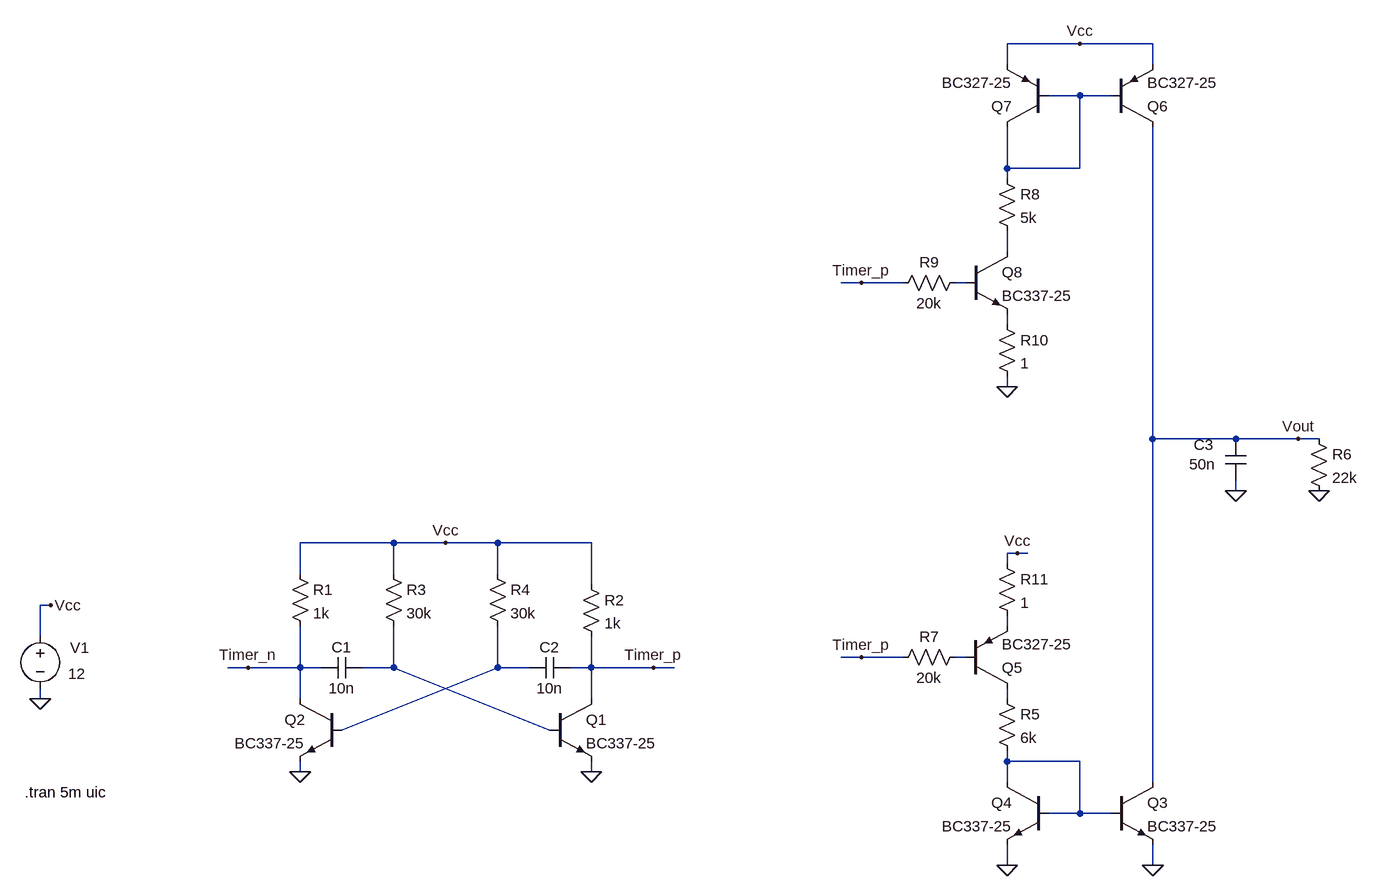
[diagram p0: schematic Proiect1_v2.asc]
Proiect1_v2.asc, the LTspice schematic file:
Version 4
SHEET 1 1956 956
WIRE 1088 -928 976 -928
WIRE 1200 -928 1088 -928
WIRE 976 -896 976 -928
WIRE 1200 -896 1200 -928
WIRE 1088 -848 1040 -848
WIRE 1136 -848 1088 -848
WIRE 976 -736 976 -800
WIRE 1088 -736 1088 -848
WIRE 1088 -736 976 -736
WIRE 976 -720 976 -736
WIRE 976 -608 976 -640
WIRE 752 -560 720 -560
WIRE 816 -560 752 -560
WIRE 912 -560 896 -560
WIRE 976 -496 976 -512
WIRE 976 -400 976 -416
WIRE 1200 -320 1200 -800
WIRE 1328 -320 1200 -320
WIRE 1424 -320 1328 -320
WIRE 1456 -320 1424 -320
WIRE 1328 -240 1328 -256
WIRE 32 -160 -112 -160
WIRE 112 -160 32 -160
WIRE 192 -160 112 -160
WIRE 336 -160 192 -160
WIRE 992 -144 976 -144
WIRE 1008 -144 992 -144
WIRE 976 -128 976 -144
WIRE -112 -112 -112 -160
WIRE 32 -112 32 -160
WIRE 192 -112 192 -160
WIRE 336 -96 336 -160
WIRE -496 -64 -512 -64
WIRE 976 -32 976 -48
WIRE -512 -16 -512 -64
WIRE 752 16 720 16
WIRE 816 16 752 16
WIRE 912 16 896 16
WIRE -192 32 -224 32
WIRE -112 32 -112 -32
WIRE -112 32 -192 32
WIRE -80 32 -112 32
WIRE 32 32 32 -32
WIRE 32 32 -16 32
WIRE 192 32 192 -32
WIRE 240 32 192 32
WIRE 336 32 336 -16
WIRE 336 32 304 32
WIRE 432 32 336 32
WIRE 464 32 432 32
WIRE -512 80 -512 64
WIRE -112 80 -112 32
WIRE 336 80 336 32
WIRE 976 80 976 64
WIRE -48 128 192 32
WIRE 272 128 32 32
WIRE 976 176 976 160
WIRE 1088 176 976 176
WIRE -112 192 -112 176
WIRE 336 192 336 176
WIRE 976 208 976 176
WIRE 1200 208 1200 -320
WIRE 1088 256 1088 176
WIRE 1088 256 1040 256
WIRE 1136 256 1088 256
WIRE 976 336 976 304
WIRE 1200 336 1200 304
FLAG -112 192 0
FLAG 336 192 0
FLAG -512 80 0
FLAG -496 -64 Vcc
FLAG 112 -160 Vcc
FLAG 432 32 Timer_p
FLAG -192 32 Timer_n
FLAG 976 336 0
FLAG 1200 336 0
FLAG 1328 -240 0
FLAG 1456 -240 0
FLAG 992 -144 Vcc
FLAG 1088 -928 Vcc
FLAG 1424 -320 Vout
FLAG 752 -560 Timer_p
FLAG 752 16 Timer_p
FLAG 976 -400 0
SYMBOL npn 272 80 R0
SYMATTR InstName Q1
SYMATTR Value BC337-25
SYMBOL npn -48 80 M0
SYMATTR InstName Q2
SYMATTR Value BC337-25
SYMBOL res -128 -128 R0
SYMATTR InstName R1
SYMATTR Value 1k
SYMBOL res 320 -112 R0
SYMATTR InstName R2
SYMATTR Value 1k
SYMBOL cap -16 16 R90
WINDOW 0 0 32 VBottom 2
WINDOW 3 32 32 VTop 2
SYMATTR InstName C1
SYMATTR Value 10n
SYMBOL cap 304 16 R90
WINDOW 0 0 32 VBottom 2
WINDOW 3 32 32 VTop 2
SYMATTR InstName C2
SYMATTR Value 10n
SYMBOL res 16 -128 R0
SYMATTR InstName R3
SYMATTR Value 30k
SYMBOL res 176 -128 R0
SYMATTR InstName R4
SYMATTR Value 30k
SYMBOL voltage -512 -32 R0
WINDOW 0 46 33 Left 2
WINDOW 3 43 73 Left 2
WINDOW 123 0 0 Left 0
WINDOW 39 0 0 Left 0
SYMATTR InstName V1
SYMATTR Value 12
SYMBOL npn 1136 208 R0
SYMATTR InstName Q3
SYMATTR Value BC337-25
SYMBOL npn 1040 208 M0
SYMATTR InstName Q4
SYMATTR Value BC337-25
SYMBOL res 960 64 R0
SYMATTR InstName R5
SYMATTR Value 6k
SYMBOL cap 1344 -256 R180
WINDOW 0 50 55 Left 2
WINDOW 3 47 25 Left 2
SYMATTR InstName C3
SYMATTR Value 50n
SYMBOL res 1440 -336 R0
SYMATTR InstName R6
SYMATTR Value 22k
SYMBOL pnp 912 64 M180
SYMATTR InstName Q5
SYMATTR Value BC327-25
SYMBOL res 912 0 R90
WINDOW 0 0 56 VBottom 2
WINDOW 3 32 56 VTop 2
SYMATTR InstName R7
SYMATTR Value 20k
SYMBOL pnp 1136 -800 M180
SYMATTR InstName Q6
SYMATTR Value BC327-25
SYMBOL pnp 1040 -800 R180
SYMATTR InstName Q7
SYMATTR Value BC327-25
SYMBOL res 960 -736 R0
SYMATTR InstName R8
SYMATTR Value 5k
SYMBOL npn 912 -608 R0
SYMATTR InstName Q8
SYMATTR Value BC337-25
SYMBOL res 912 -576 R90
WINDOW 0 0 56 VBottom 2
WINDOW 3 32 56 VTop 2
SYMATTR InstName R9
SYMATTR Value 20k
SYMBOL res 960 -512 R0
SYMATTR InstName R10
SYMATTR Value 1
SYMBOL res 960 -144 R0
SYMATTR InstName R11
SYMATTR Value 1
TEXT -536 224 Left 2 !.tran 5m uic

The netlist it stands for:
* Proiect1_v2.asc
Q1 Timer_p N007 0 0 BC337-25
Q2 Timer_n N008 0 0 BC337-25
R1 Vcc Timer_n 1k
R2 Vcc Timer_p 1k
C1 N007 Timer_n 10n
C2 Timer_p N008 10n
R3 Vcc N007 30k
R4 Vcc N008 30k
V1 Vcc 0 12
Q3 Vout N010 0 0 BC337-25
Q4 N010 N010 0 0 BC337-25
R5 N009 N010 6k
C3 0 Vout 50n
R6 Vout 0 22k
Q5 N009 N006 N005 0 BC327-25
R7 N006 Timer_p 20k
Q6 Vout N001 Vcc 0 BC327-25
Q7 N001 N001 Vcc 0 BC327-25
R8 N001 N002 5k
Q8 N002 N003 N004 0 BC337-25
R9 N003 Timer_p 20k
R10 N004 0 1
R11 Vcc N005 1
.model NPN NPN
.model PNP PNP
.lib standard.bjt
.tran 5m uic
.backanno
.end